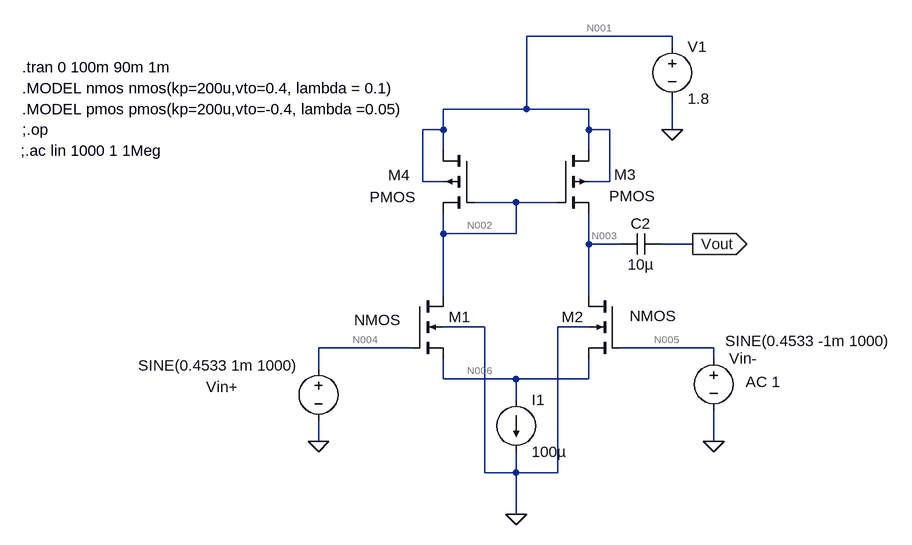
[diagram p0: schematic Unbalanced_Differential_to_single_Amplifier.asc]
Unbalanced_Differential_to_single_Amplifier.asc, the LTspice schematic file:
Version 4
SHEET 1 888 680
WIRE 464 -240 240 -240
WIRE 464 -224 464 -240
WIRE 240 -128 240 -240
WIRE 240 -128 112 -128
WIRE 336 -128 240 -128
WIRE 112 -96 112 -128
WIRE 112 -96 80 -96
WIRE 336 -96 336 -128
WIRE 368 -96 336 -96
WIRE 464 -96 464 -144
WIRE 112 -64 112 -96
WIRE 336 -64 336 -96
WIRE 80 -16 80 -96
WIRE 112 -16 80 -16
WIRE 368 -16 368 -96
WIRE 368 -16 336 -16
WIRE 224 16 160 16
WIRE 288 16 224 16
WIRE 112 64 112 32
WIRE 224 64 224 16
WIRE 224 64 112 64
WIRE 336 80 336 32
WIRE 384 80 336 80
WIRE 496 80 448 80
WIRE 112 160 112 64
WIRE 336 160 336 80
WIRE 176 208 112 208
WIRE 336 208 288 208
WIRE 64 240 -80 240
WIRE 528 240 384 240
WIRE 528 256 528 240
WIRE -80 272 -80 240
WIRE 112 288 112 256
WIRE 224 288 112 288
WIRE 336 288 336 256
WIRE 336 288 224 288
WIRE 224 320 224 288
WIRE -80 384 -80 352
WIRE 528 384 528 336
WIRE 176 432 176 208
WIRE 224 432 224 400
WIRE 224 432 176 432
WIRE 288 432 288 208
WIRE 288 432 224 432
WIRE 224 496 224 432
FLAG 464 -96 0
FLAG 224 496 0
FLAG -80 384 0
FLAG 528 384 0
FLAG 496 80 Vout
IOPIN 496 80 Out
SYMBOL current 224 320 R0
WINDOW 123 0 0 Left 0
WINDOW 39 0 0 Left 0
SYMATTR InstName I1
SYMATTR Value 100µ
SYMBOL voltage 464 -240 R0
WINDOW 123 0 0 Left 0
WINDOW 39 0 0 Left 0
SYMATTR InstName V1
SYMATTR Value 1.8
SYMBOL voltage -80 256 R0
WINDOW 0 -173 44 Left 2
WINDOW 123 24 124 Left 2
WINDOW 39 0 0 Left 0
WINDOW 3 -277 11 Left 2
SYMATTR InstName Vin+
SYMATTR Value SINE(0.4533 1m 1000)
SYMBOL voltage 528 240 R0
WINDOW 3 18 -11 Left 2
WINDOW 123 49 52 Left 2
WINDOW 39 0 0 Left 0
SYMATTR Value SINE(0.4533 -1m 1000)
SYMATTR Value2 AC 1
SYMATTR InstName Vin-
SYMBOL cap 384 64 M90
WINDOW 0 0 32 VBottom 2
WINDOW 3 32 32 VTop 2
SYMATTR InstName C2
SYMATTR Value 10µ
SYMBOL nmos4 64 160 R0
WINDOW 3 -89 37 Left 2
SYMATTR InstName M1
SYMATTR Value2 l=1u w=176u
SYMBOL nmos4 384 160 M0
WINDOW 3 -87 31 Left 2
SYMATTR InstName M2
SYMATTR Value2 l=1u w=176u
SYMBOL pmos4 288 -64 R0
WINDOW 0 87 37 Left 2
WINDOW 3 79 70 Left 2
SYMATTR InstName M3
SYMATTR Value2 l=10u w=10u
SYMBOL pmos4 160 -64 M0
WINDOW 0 99 38 Left 2
WINDOW 3 91 72 Left 2
SYMATTR InstName M4
SYMATTR Value2 l=10u w=10u
TEXT -536 -192 Left 2 !.tran 0 100m 90m 1m
TEXT -536 -160 Left 2 !.MODEL nmos nmos(kp=200u,vto=0.4, lambda = 0.1)
TEXT -536 -128 Left 2 !.MODEL pmos pmos(kp=200u,vto=-0.4, lambda =0.05)
TEXT -536 -96 Left 2 !;.op
TEXT -538 -64 Left 2 !;.ac lin 1000 1 1Meg

The netlist it stands for:
* Unbalanced_Differential_to_single_Amplifier.asc
I1 N006 0 100µ
V1 N001 0 1.8
Vin+ N004 0 SINE(0.4533 1m 1000)
Vin- N005 0 SINE(0.4533 -1m 1000) AC 1
C2 N003 Vout 10µ
M1 N002 N004 N006 0 NMOS l=1u w=176u
M2 N003 N005 N006 0 NMOS l=1u w=176u
M3 N001 N002 N003 N001 PMOS l=10u w=10u
M4 N001 N002 N002 N001 PMOS l=10u w=10u
.model NMOS NMOS
.model PMOS PMOS
.lib standard.mos
.tran 0 100m 90m 1m
.MODEL nmos nmos(kp=200u,vto=0.4, lambda = 0.1)
.MODEL pmos pmos(kp=200u,vto=-0.4, lambda =0.05)
;.op
;.ac lin 1000 1 1Meg
.backanno
.end

* Results of the author's LTspice run, read from the files saved beside the schematic
* Operating Point, zero values left out:
*   V(n006) = 1.796 mV
*   V(n001) = 1.8 V
*   V(n004) = 453.3 mV
*   V(n005) = 453.3 mV
*   V(n003) = 711.4 mV
*   V(vout) = 7.114 µV
*   V(n002) = 711.4 mV
*   Id(M4) = 50 µA
*   Ib(M4) = 1.099 pA
*   Is(M4) = -50 µA
*   Id(M3) = 50 µA
*   Ib(M3) = 1.099 pA
*   Is(M3) = -50 µA
*   Id(M2) = 50 µA
*   Is(M2) = -50 µA
*   Id(M1) = 50 µA
*   Is(M1) = -50 µA
*   I(I1) = 100 µA
*   I(V1) = -100 µA
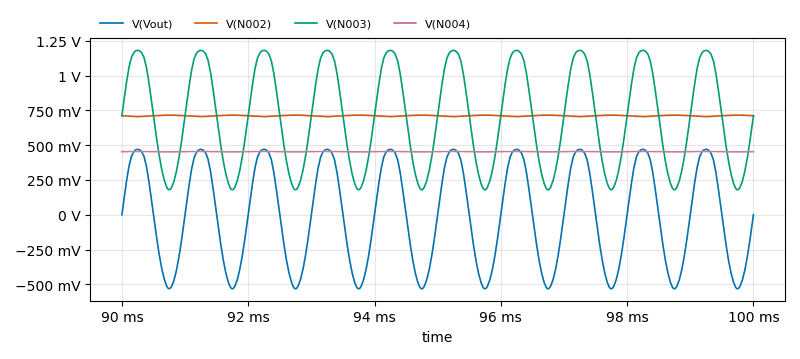
[diagram p1: Transient Analysis of Unbalanced_Differential_to_single_Amplifier.asc, plotted from the saved traces]
* Transient Analysis, 1 run:
*   V(Vout): min -532.2 mV, max 470 mV, average -7.153 mV, rms 365 mV, last 7.05 µV
*   V(N002): min 705.5 mV, max 715.7 mV, average 711.1 mV, rms 711.1 mV, last 711.4 mV
*   V(N003): min 179.2 mV, max 1.181 V, average 704.2 mV, rms 793.2 mV, last 711.4 mV
*   V(N004): min 452.3 mV, max 454.3 mV, average 453.3 mV, rms 453.3 mV, last 453.3 mV